# EAGLE design LPF Schematic (EAGLE 9.3.2)
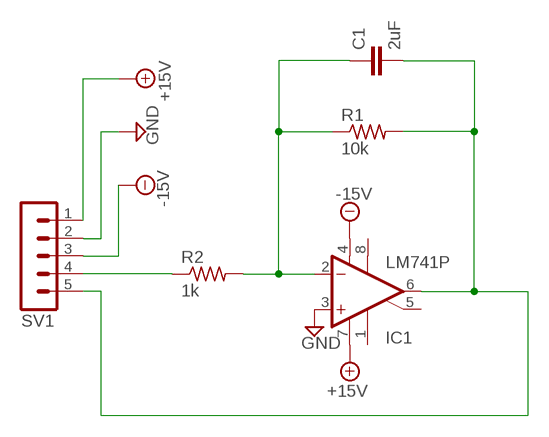
[diagram p0: schematic, sheet 1]

## Parts
C1  2uF  C-EUC0603  [C0603]
IC1  LM741P  [DIL08]
R1  10k  R-US_R0603  [R0603]
R2  1k  R-US_R0603  [R0603]
SV1  MA05-1  [MA05-1]

## Nets
+15V: IC1.7(V+) SV1.1
-15V: IC1.4(V-) SV1.3
GND: IC1.3(+IN) SV1.2
N$1: C1.1 IC1.2(-IN) R1.1 R2.2
N$2: C1.2 IC1.6(OUT) R1.2 SV1.5
N$3: R2.1 SV1.4
Unconnected: IC1.1(ON1) IC1.5(ON2) IC1.8(OPT)

## Library data of the parts
C1 = rcl:C-EU: CAPACITOR, European symbol; SPICEPREFIX: C
IC1 = linear:*741: OP AMP
R1 R2 = rcl:R-US_: RESISTOR, American symbol; SPICEPREFIX: R
SV1 = con-lstb:MA05-1: PIN HEADER; OC_FARNELL: unknown; OC_NEWARK: unknown

## Board
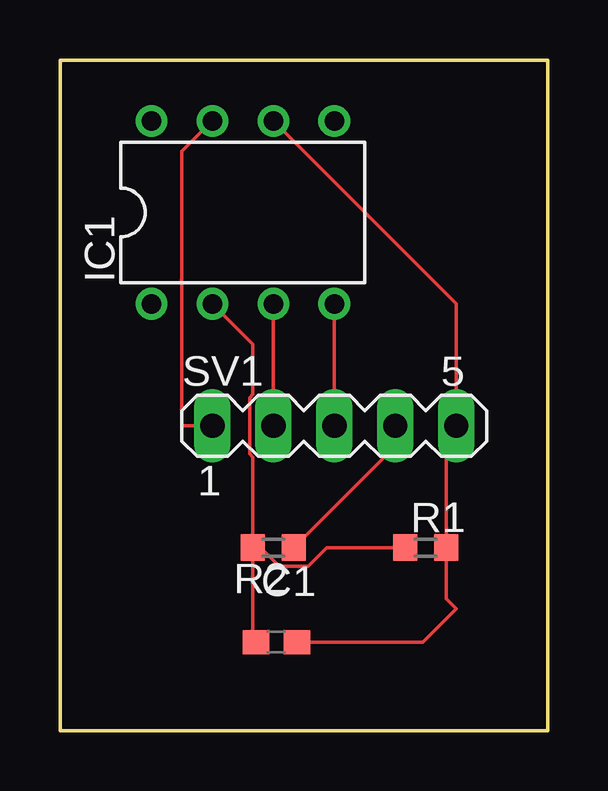
[diagram p1: board, top side]

Size 20.32 x 27.94 mm. Coordinates in mm from the lower left corner, seen from the top.
Outline: 20.32,27.94 20.32,0 0,0 0,27.94 20.32,27.94
Copper layers (1*16): Top 0.035mm / dielectric 1.5mm / Bottom 0.035mm
Design rules "default": minimum track width 6mil, minimum drill 0.35mm, track to track 6mil, track to pad 6mil, pad to pad 6mil, via to via 6mil, smd to smd 6mil, copper to edge 40mil, drill to drill 6mil, minimum pad ring 10mil, minimum via ring 8mil, stop-mask expansion 4mil, vias tented up to drill 0mil, thermal gap 10mil

### Footprints (pad centres in the part's own frame; a part is rotated, then mirrored left to right if it is on the bottom)
C0603 = smd 1.1 x 1: 1 -0.85,0; 2 0.85,0
DIL08 = drill 0.813 pad 1.27: 1 -3.81,-3.81; 2 -1.27,-3.81; 3 1.27,-3.81; 4 3.81,-3.81; 5 3.81,3.81; 6 1.27,3.81; 7 -1.27,3.81; 8 -3.81,3.81
R0603 = smd 1 x 1.1: 1 -0.85,0; 2 0.85,0
MA05-1 = drill 1.016 long: 1 -5.08,0; 2 -2.54,0; 3 0,0; 4 2.54,0; 5 5.08,0

### Placement (x,y rotation side)
C1  9.02,3.68 0 top
IC1  7.62,21.59 0 top
R1  15.24,7.62 0 top
R2  8.89,7.62 180 top
SV1  11.43,12.7 0 top

### Tracks (layer width: path | path; a pad name or v marks a point on that pad's centre or on a via)
+15V
  Top 0.152: IC1.7 5.08,24.13 5.08,12.7 SV1.1
-15V
  Top 0.152: IC1.4 SV1.3
GND
  Top 0.152: IC1.3 SV1.2
N$1
  Top 0.152: IC1.2 8.04,16.09 8.04,14.01 7.9,13.87 7.9,11.53 8.04,11.39 R2.2 | R2.2 8.04,3.81 C1.1 | R1.1 11.11,7.62 10.34,6.84 9.14,6.84 8.37,7.62 R2.2
N$2
  Top 0.152: IC1.6 16.51,17.78 SV1.5 16.09,12.28 R1.2 16.09,5.5 16.51,5.08 15.11,3.68 C1.2
N$3
  Top 0.152: R2.1 13.97,11.85 SV1.4